# EAGLE schematic Modulo Ignicao Enertron (EAGLE 7.2.0)
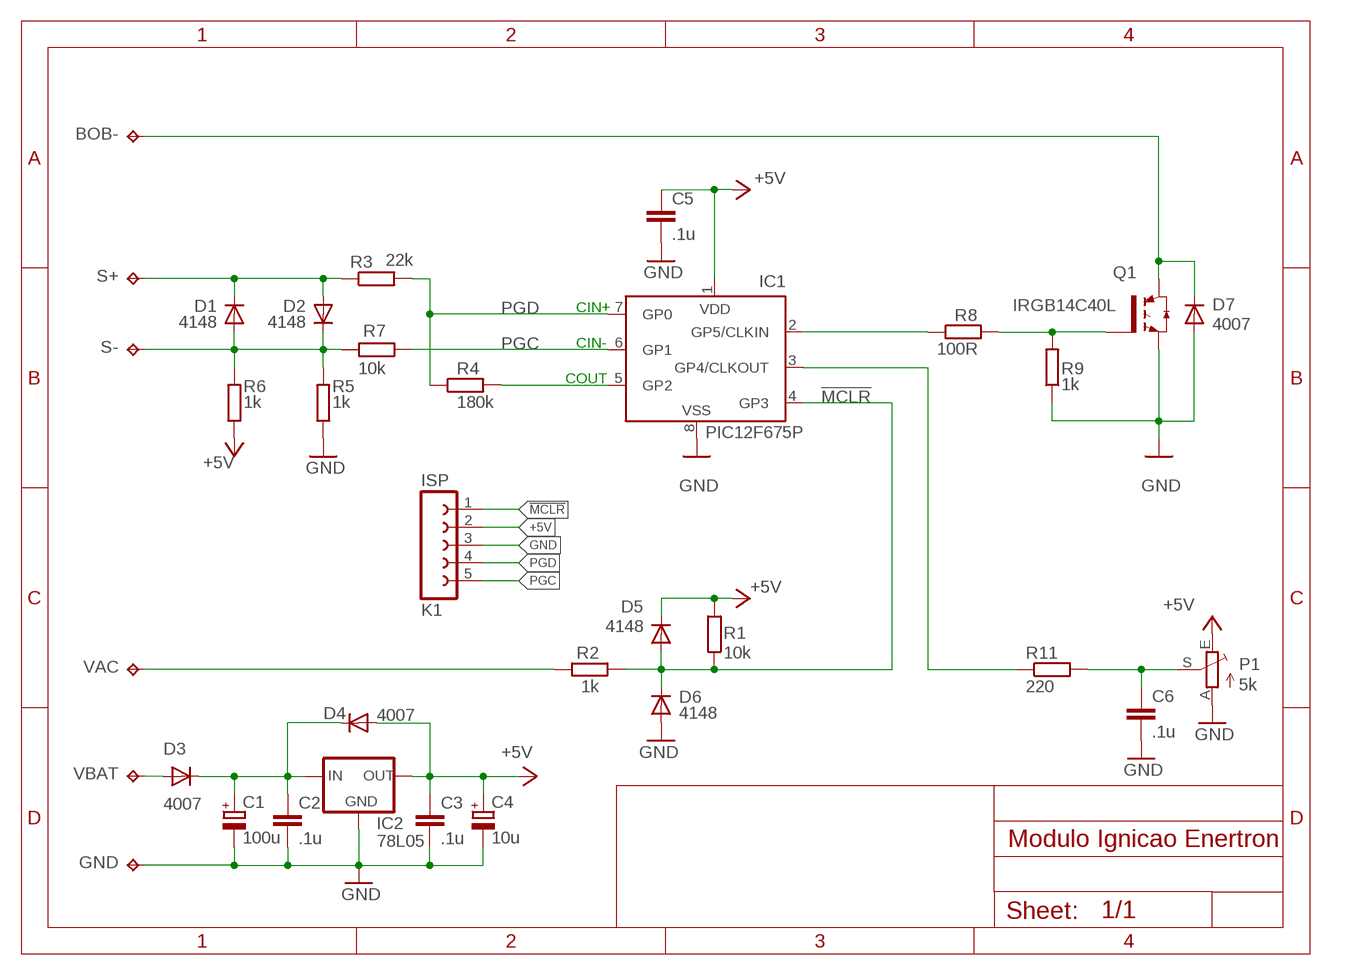
[diagram p0: schematic, sheet 1]

## Parts
BOB-  TPPAD1-13Y  [P1-13Y]
C1  100u  CPOL-EUE2.5-6  [E2,5-6]
C2  .1u  C-EU050-024X044  [C050-024X044]
C3  .1u  C-EU050-024X044  [C050-024X044]
C4  10u  CPOL-EUE2-4  [E2-4]
C5  .1u  C-EU050-024X044  [C050-024X044]
C6  .1u  C-EU050-024X044  [C050-024X044]
D1  4148  DIODE-D-5  [D-5]
D2  4148  DIODE-D-5  [D-5]
D3  4007  DIODE-D-7.5  [D-7.5]
D4  4007  DIODE-D-7.5  [D-7.5]
D5  4148  DIODE-D-5  [D-5]
D6  4148  DIODE-D-5  [D-5]
D7  4007  DIODE-D-7.5  [D-7.5]
GND  TPPAD1-13Y  [P1-13Y]
IC1  PIC12F675P  [DIL8]
IC2  78L05  78LXX  [78LXX]
K1  ISP  FE05-1  [FE05-1]
P1  5k  TRIM_EU-CA6V  [CA6V]
Q1  IRGB14C40L  IRG4BC15UD--L  [TO262-V]
R1  10k  R-EU_0204/7  [0204/7]
R2  1k  R-EU_0204/7  [0204/7]
R3  22k  R-EU_0204/7  [0204/7]
R4  180k  R-EU_0204/7  [0204/7]
R5  1k  R-EU_0204/7  [0204/7]
R6  1k  R-EU_0204/7  [0204/7]
R7  10k  R-EU_0204/7  [0204/7]
R8  100R  R-EU_0204/7  [0204/7]
R9  1k  R-EU_0204/7  [0204/7]
R11  220  R-EU_0204/7  [0204/7]
S+  TPPAD1-13Y  [P1-13Y]
S-  TPPAD1-13Y  [P1-13Y]
VAC  TPPAD1-13Y  [P1-13Y]
VBAT  TPPAD1-13Y  [P1-13Y]

## Nets
!MCLR: D5.A D6.C IC1.4(GP3) K1.1 R1.1 R2.1
+5V: C3.1 C4.+ C5.1 D4.A D5.C IC1.1(VDD) IC2.OUT K1.2 P1.E R1.2 R6.1
COUT: IC1.5(GP2) R4.2
GND: C1.- C2.2 C3.2 C4.- C5.2 C6.2 D6.A D7.A GND.TP IC1.8(VSS) IC2.GND K1.3 P1.A Q1.3(E) R5.1 R9.1
N$1: C1.+ C2.1 D3.C D4.C IC2.IN
N$2: D1.A D2.C R5.2 R6.2 R7.2 S-.TP
N$3: IC1.2(GP5/CLKIN) R8.1
N$5: D1.C D2.A R3.1 S+.TP
N$6: Q1.1(G) R8.2 R9.2
N$7: D3.A VBAT.TP
N$8: IC1.3(GP4/CLKOUT) R11.1
N$9: C6.1 P1.S R11.2
N$10: BOB-.TP D7.C Q1.2(C)
N$11: R2.2 VAC.TP
PGC: IC1.6(GP1) K1.5 R7.1
PGD: IC1.7(GP0) K1.4 R3.2 R4.1

## Notes on the sheet
- CIN+
- CIN-
- COUT

## Library data of the parts
BOB- GND S+ S- VAC VBAT = testpad:TP: Test pad
C1 C4 = rcl:CPOL-EU: POLARIZED CAPACITOR, European symbol
C2 C3 C5 C6 = rcl:C-EU: CAPACITOR, European symbol
D1-D7 = diode:DIODE-: DIODE
IC1 = microchip:PIC12F6*: Data Sheet 8-Pin FLASH-Based 8-Bit CMOS Microcontrollers Source: http://www.microchip.com .. 41190c.pdf; MF: MICROCHIP; MPN: PIC12F675-E/P; OC_FARNELL: 9759018; OC_NEWARK: 92C4340
IC2 = v-reg:78LXX: VOLTAGE REGULATOR
K1 = con-lsta:FE05-1: FEMALE HEADER; OC_FARNELL: unknown; OC_NEWARK: unknown
P1 = pot:TRIM_EU-: POTENTIOMETER
Q1 = transistor-power:IRG4BC15UD-: INSULATED GATE BIPOLAR TRANSISTOR WITH ULTRAFAST SOFT RECOVERY DIODE
R1-R9 R11 = rcl:R-EU_: RESISTOR, European symbol